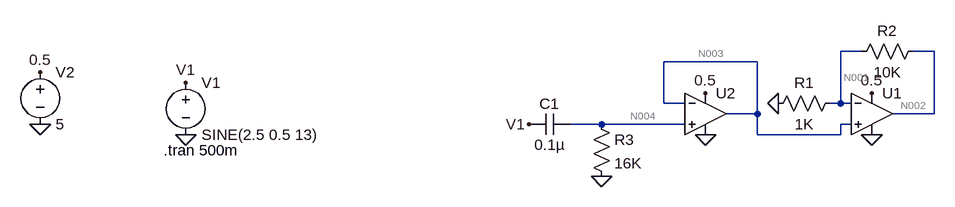
[diagram p0: schematic Draft1.asc]
Draft1.asc, the LTspice schematic file:
Version 4
SHEET 1 880 680
WIRE 368 -16 336 -16
WIRE 480 -16 448 -16
WIRE 208 0 64 0
WIRE 64 64 64 0
WIRE 96 64 64 64
WIRE 336 64 336 -16
WIRE 336 64 320 64
WIRE 352 64 336 64
WIRE 208 80 208 0
WIRE 208 80 160 80
WIRE 480 80 480 -16
WIRE 480 80 416 80
WIRE -32 96 -80 96
WIRE 96 96 -32 96
WIRE 352 96 336 96
WIRE 208 112 208 80
WIRE 336 112 336 96
WIRE 336 112 208 112
FLAG -672 112 0
FLAG -672 32 V1
FLAG -144 96 V1
FLAG -896 96 0
FLAG -896 16 0.5
FLAG 384 48 0.5
FLAG 384 112 0
FLAG 240 64 0
FLAG -32 176 0
FLAG 128 112 0
FLAG 128 48 0.5
SYMBOL voltage -672 16 R0
WINDOW 123 0 0 Left 0
WINDOW 39 0 0 Left 0
SYMATTR InstName V1
SYMATTR Value SINE(2.5 0.5 13)
SYMBOL cap -80 80 R90
WINDOW 0 0 32 VBottom 2
WINDOW 3 32 32 VTop 2
SYMATTR InstName C1
SYMATTR Value 0.1µ
SYMBOL voltage -896 0 R0
WINDOW 123 0 0 Left 0
WINDOW 39 0 0 Left 0
SYMATTR InstName V2
SYMATTR Value 5
SYMBOL Opamps\\UniversalOpamp2 384 80 R0
SYMATTR InstName U1
SYMBOL res 336 48 R90
WINDOW 0 0 56 VBottom 2
WINDOW 3 32 56 VTop 2
SYMATTR InstName R1
SYMATTR Value 1K
SYMBOL res 464 -32 R90
WINDOW 0 0 56 VBottom 2
WINDOW 3 32 56 VTop 2
SYMATTR InstName R2
SYMATTR Value 10K
SYMBOL res -48 80 R0
SYMATTR InstName R3
SYMATTR Value 16K
SYMBOL Opamps\\UniversalOpamp2 128 80 R0
SYMATTR InstName U2
TEXT -706 136 Left 2 !.tran 500m

The netlist it stands for:
* Draft1.asc
V1 V1 0 SINE(2.5 0.5 13)
C1 N004 V1 0.1µ
V2 0.5 0 5
XU1 N003 N001 0.5 0 N002 level.2 Avol=1Meg GBW=10Meg Slew=10Meg ilimit=25m rail=0 Vos=0 phimargin=45 en=0 enk=0 in=0 ink=0 Rin=500Meg  ; pins IN+ IN- V+ V- OUT
R1 N001 0 1K
R2 N002 N001 10K
R3 N004 0 16K
XU2 N004 N003 0.5 0 N003 level.2 Avol=1Meg GBW=10Meg Slew=10Meg ilimit=25m rail=0 Vos=0 phimargin=45 en=0 enk=0 in=0 ink=0 Rin=500Meg  ; pins IN+ IN- V+ V- OUT
.tran 500m
.lib UniversalOpamps2.sub
.backanno
.end

* Results of the author's LTspice run, read from the files saved beside the schematic
* Operating Point, zero values left out:
*   V(v1) = 2.5 V
*   V(n004) = 80 µV
*   V(0.5) = 5 V
*   V(n002) = 43.19 mV
*   V(n001) = 3.931 mV
*   V(n003) = 3.44 mV
*   I(R3) = 5 nA
*   I(R2) = 3.926 µA
*   I(R1) = 3.931 µA
*   I(V2) = -61.45 µA
*   Ix(u1:1) = -4.993 nA
*   Ix(u1:2) = -4.992 nA
*   Ix(u1:3) = 48.31 µA
*   Ix(u1:4) = -44.35 µA
*   Ix(u1:5) = -3.926 µA
*   Ix(u2:1) = -5 nA
*   Ix(u2:2) = -4.993 nA
*   Ix(u2:3) = 13.14 µA
*   Ix(u2:4) = -13.11 µA
*   Ix(u2:5) = 9.986 nA
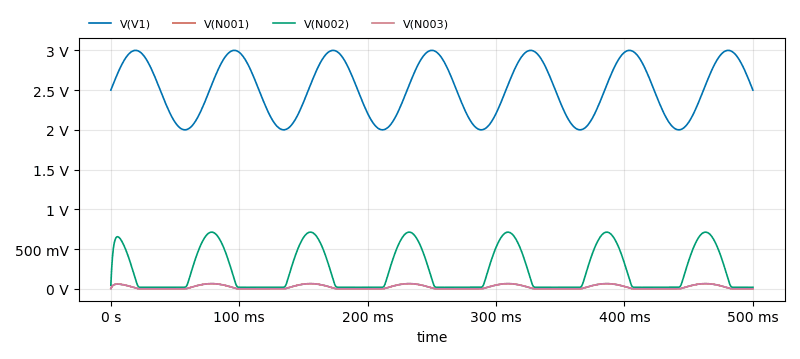
[diagram p1: Transient Analysis of Draft1.asc, plotted from the saved traces]
* Transient Analysis, 1 run:
*   V(V1): min 2 V, max 3 V, average 2.524 V, rms 2.549 V, last 2.5 V
*   V(N001): min 1.719 mV, max 64.85 mV, average 21.92 mV, rms 32.58 mV, last 1.72 mV
*   V(N002): min 18.86 mV, max 713.3 mV, average 241.1 mV, rms 358.4 mV, last 18.86 mV
*   V(N003): min 8.014 µV, max 64.84 mV, average 21.09 mV, rms 32.56 mV, last 8.04 µV